# EAGLE design Upper-Board (EAGLE 7.1.0)
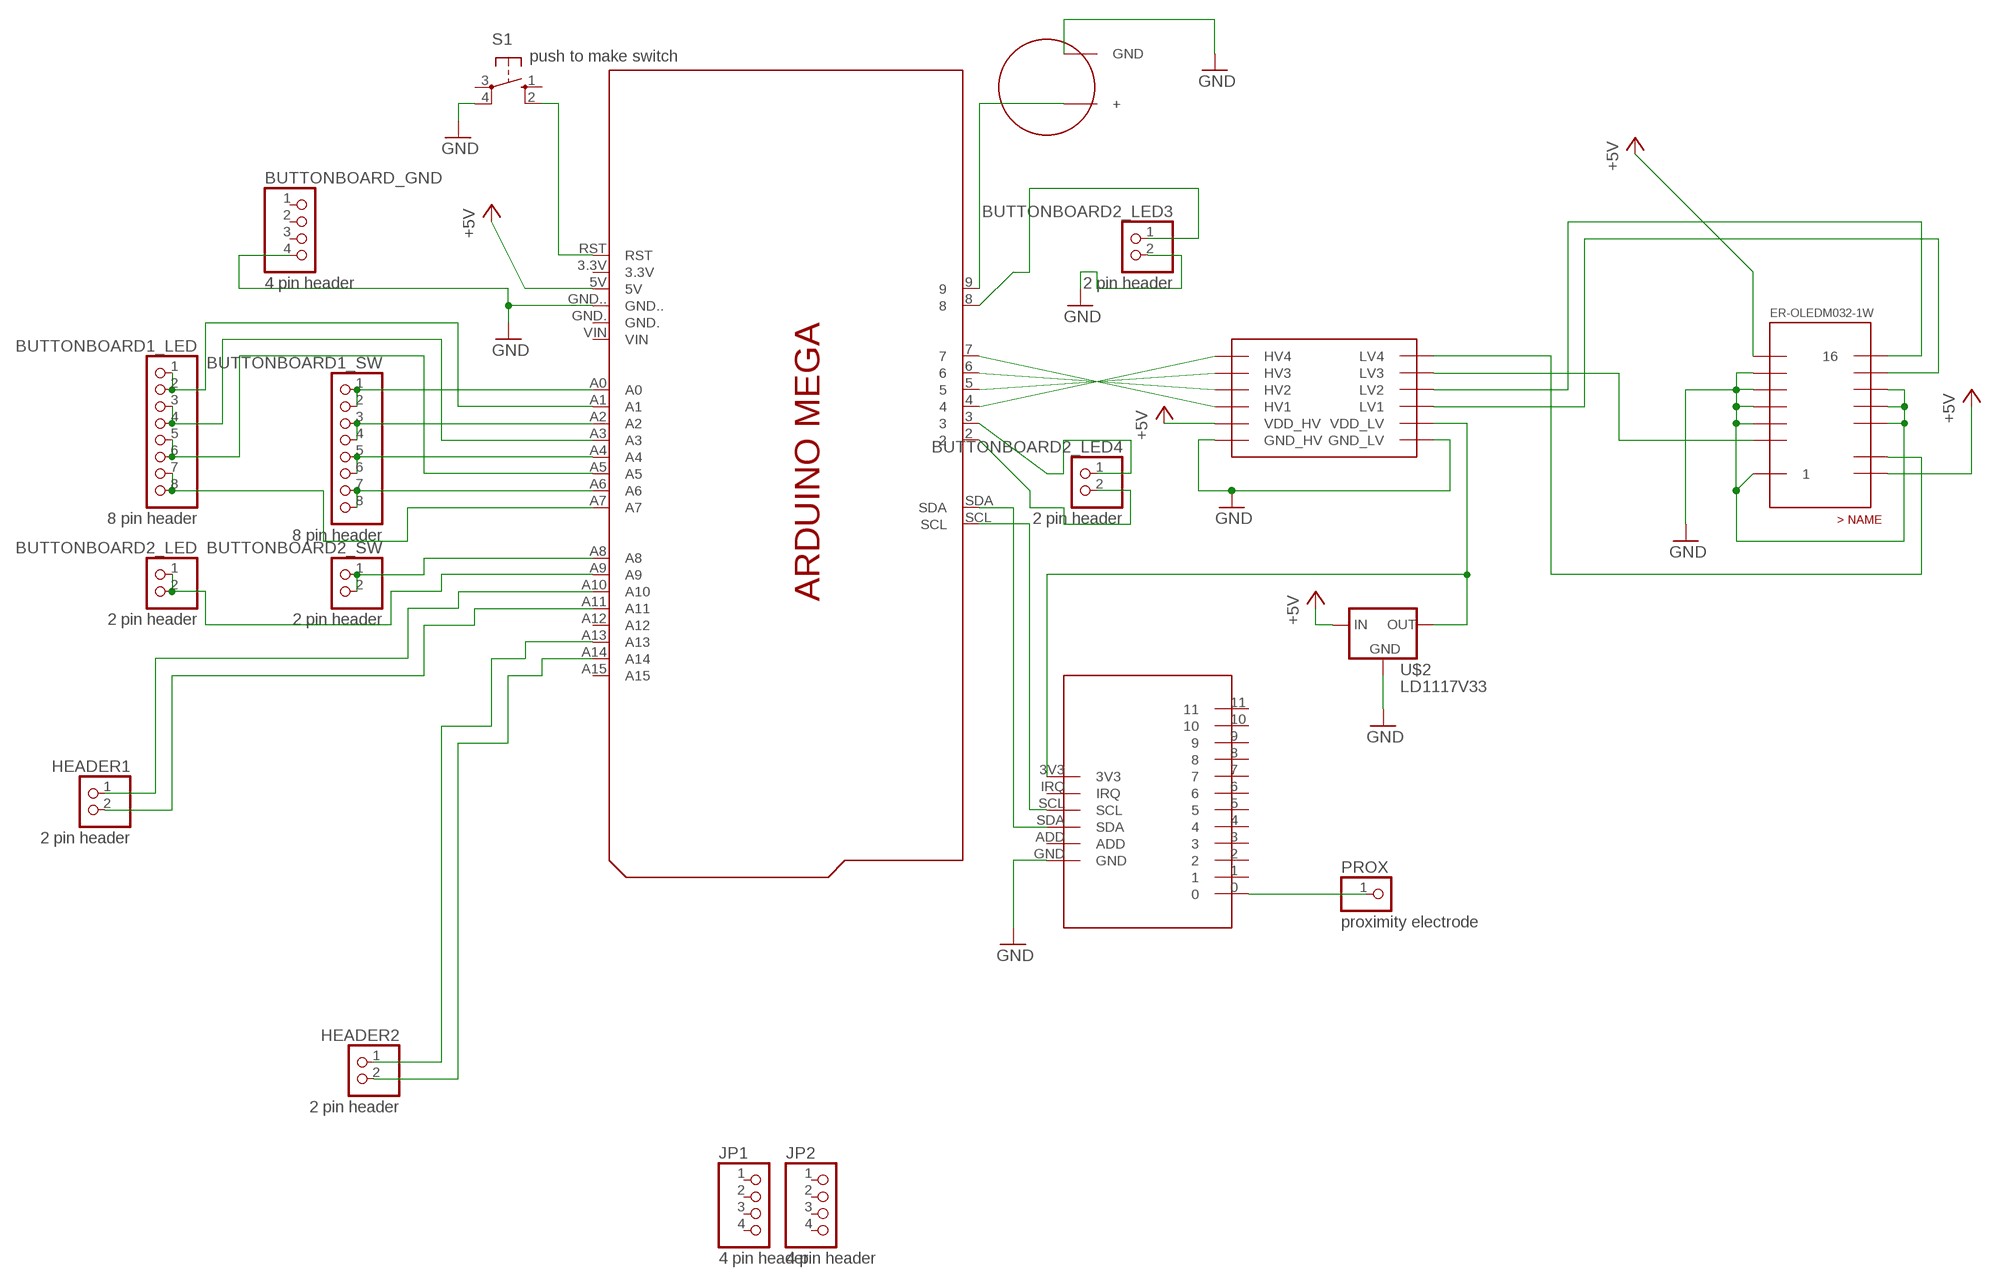
[diagram p0: schematic, sheet 1]

## Parts
BUTTONBOARD1_LED  8 pin header  PINHD-1X8  [1X08]
BUTTONBOARD1_SW  8 pin header  PINHD-1X8  [1X08]
BUTTONBOARD2_LED  2 pin header  PINHD-1X2  [1X02]
BUTTONBOARD2_LED3  2 pin header  PINHD-1X2  [1X02]
BUTTONBOARD2_LED4  2 pin header  PINHD-1X2  [1X02]
BUTTONBOARD2_SW  2 pin header  PINHD-1X2  [1X02]
BUTTONBOARD_GND  4 pin header  PINHD-1X4  [1X04]
HEADER1  2 pin header  PINHD-1X2  [1X02]
HEADER2  2 pin header  PINHD-1X2  [1X02]
JP1  4 pin header  PINHD-1X4  [1X04]
JP2  4 pin header  PINHD-1X4  [1X04]
PROX  proximity electrode  PINHD-1X1  [1X01]
S1  push to make switch  10-XX  [B3F-10XX]
U$1  ARDUINO_MEGA_2  [ARDUINO_MEGA_2]
U$2  LD1117V33  [LD1117V33]
U$3  ER-OLED-M032-1W  [ER-OLED-M032-1W]
U$4  BI_DIRECTIONAL_LEVEL_CONV  [BI_DIRECTIONAL_LEVEL_CONV]
U$5  MPR121_BREAKOUT  [MPR121_BREAKOUT]
U$6  BUZZER  [BUZZER]

## Nets
+5V: U$1.5V U$2.IN U$3.2 U$3.15 U$4.VDD_HV
GND: BUTTONBOARD2_LED3.2 BUTTONBOARD_GND.4 S1.4(P1) U$1.GND.. U$2.GND U$3.1 U$3.7 U$3.8 U$3.9 U$3.10 U$3.11 U$3.12 U$3.13 U$4.GND_HV U$4.GND_LV U$5.GND U$6.GND
N$1: BUTTONBOARD1_SW.1 BUTTONBOARD1_SW.2 U$1.A0
N$2: BUTTONBOARD1_SW.3 BUTTONBOARD1_SW.4 U$1.A2
N$3: BUTTONBOARD1_SW.5 BUTTONBOARD1_SW.6 U$1.A4
N$4: BUTTONBOARD1_SW.7 BUTTONBOARD1_SW.8 U$1.A6
N$5: BUTTONBOARD2_SW.1 BUTTONBOARD2_SW.2 U$1.A8
N$6: BUTTONBOARD1_LED.1 BUTTONBOARD1_LED.2 U$1.A1
N$7: U$1.SDA U$5.SDA
N$8: BUTTONBOARD1_LED.3 BUTTONBOARD1_LED.4 U$1.A3
N$9: BUTTONBOARD1_LED.5 BUTTONBOARD1_LED.6 U$1.A5
N$10: BUTTONBOARD1_LED.7 BUTTONBOARD1_LED.8 U$1.A7
N$11: S1.2(S1) U$1.RST
N$12: BUTTONBOARD2_LED.1 BUTTONBOARD2_LED.2 U$1.A9
N$13: U$1.SCL U$5.SCL
N$14: PROX.1 U$5.0
N$15: U$1.9 U$6.+
N$19: BUTTONBOARD2_LED3.1 U$1.8
N$20: BUTTONBOARD2_LED4.1 U$1.3
N$21: BUTTONBOARD2_LED4.2 U$1.2
N$22: U$1.4 U$4.HV4
N$23: U$1.5 U$4.HV3
N$24: U$1.6 U$4.HV2
N$25: U$1.7 U$4.HV1
N$26: U$2.OUT U$4.VDD_LV U$5.3V3
N$27: U$3.14 U$4.LV1
N$28: U$3.16 U$4.LV2
N$30: U$3.5 U$4.LV3
N$31: U$3.4 U$4.LV4
N$32: HEADER2.1 U$1.A13
N$33: HEADER2.2 U$1.A14
N$34: HEADER1.1 U$1.A10
N$35: HEADER1.2 U$1.A11
Unconnected: BUTTONBOARD_GND.1 BUTTONBOARD_GND.2 BUTTONBOARD_GND.3 JP1.1 JP1.2 JP1.3 JP1.4 JP2.1 JP2.2 JP2.3 JP2.4 S1.1(S) S1.3(P) U$1.3.3V U$1.A12 U$1.A15 U$1.GND. U$1.VIN U$5.1 U$5.2 U$5.3 U$5.4 U$5.5 U$5.6 U$5.7 U$5.8 U$5.9 U$5.10 U$5.11 U$5.ADD U$5.IRQ

## Library data of the parts
BUTTONBOARD1_LED BUTTONBOARD1_SW = pinhead:PINHD-1X8: PIN HEADER
BUTTONBOARD2_LED BUTTONBOARD2_LED3 BUTTONBOARD2_LED4 BUTTONBOARD2_SW HEADER1 HEADER2 = pinhead:PINHD-1X2: PIN HEADER
BUTTONBOARD_GND JP1 JP2 = pinhead:PINHD-1X4: PIN HEADER
PROX = pinhead:PINHD-1X1: PIN HEADER
S1 = switch-omron:10-XX: OMRON SWITCH; MPN: B3F-1000; OC_FARNELL: 176432; OC_NEWARK: 36M3542
U$1 = Mat-Library:ARDUINO_MEGA_2
U$2 = LD1117V33:LD1117V33
U$3 = Mat-Library:ER-OLED-M032-1W: 256x64 White OLED from buydisplay.com. ER-OLED-M032-1W ER = East Rising (Manufacturer) OLED = OLED M = module - this is the product with the driver board
U$4 = Mat-Library:BI_DIRECTIONAL_LEVEL_CONV
U$5 = Mat-Library:MPR121_BREAKOUT
U$6 = Mat-Library:BUZZER

## Board
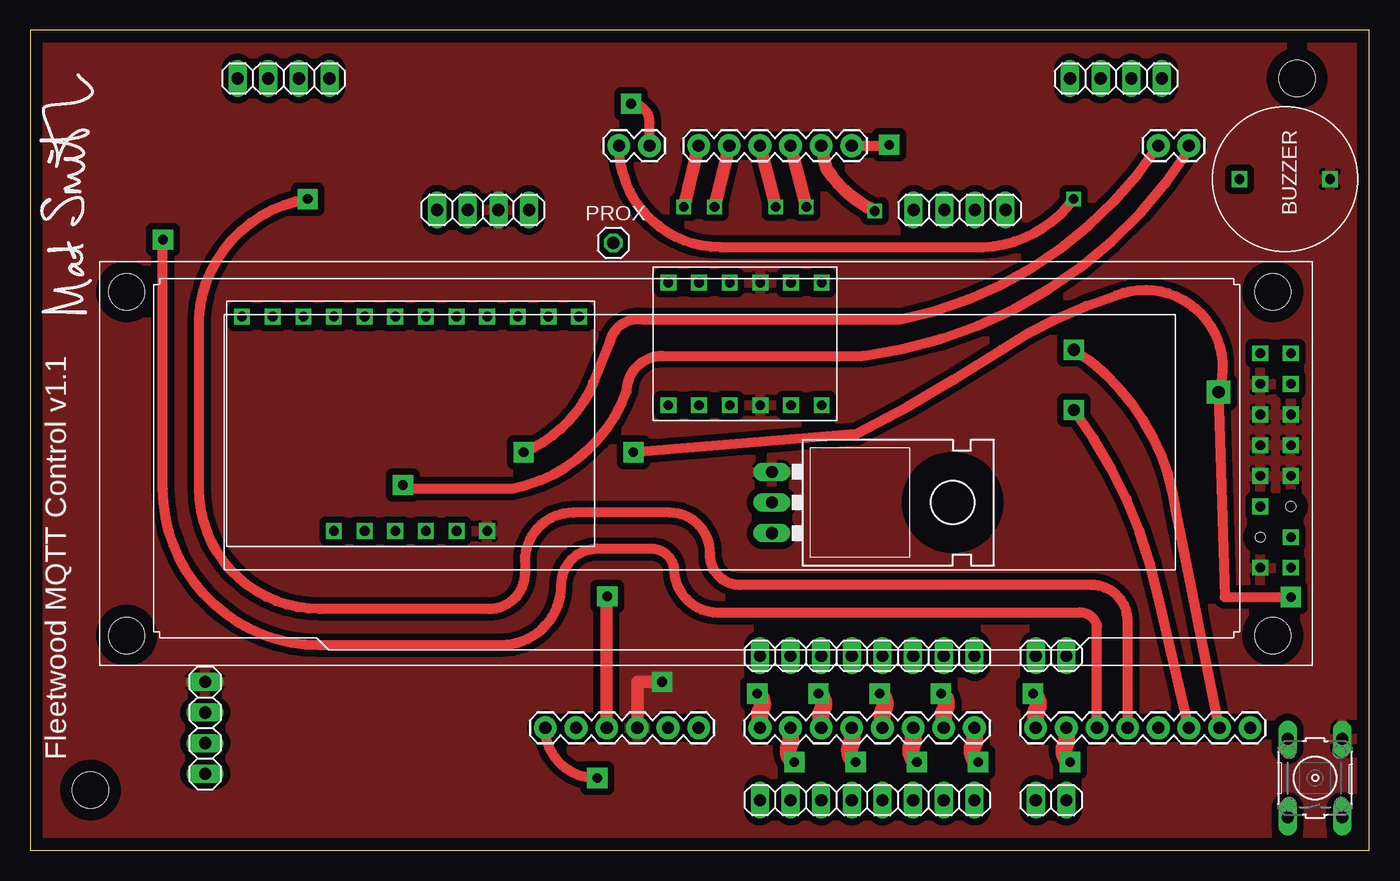
[diagram p1: board, top side]
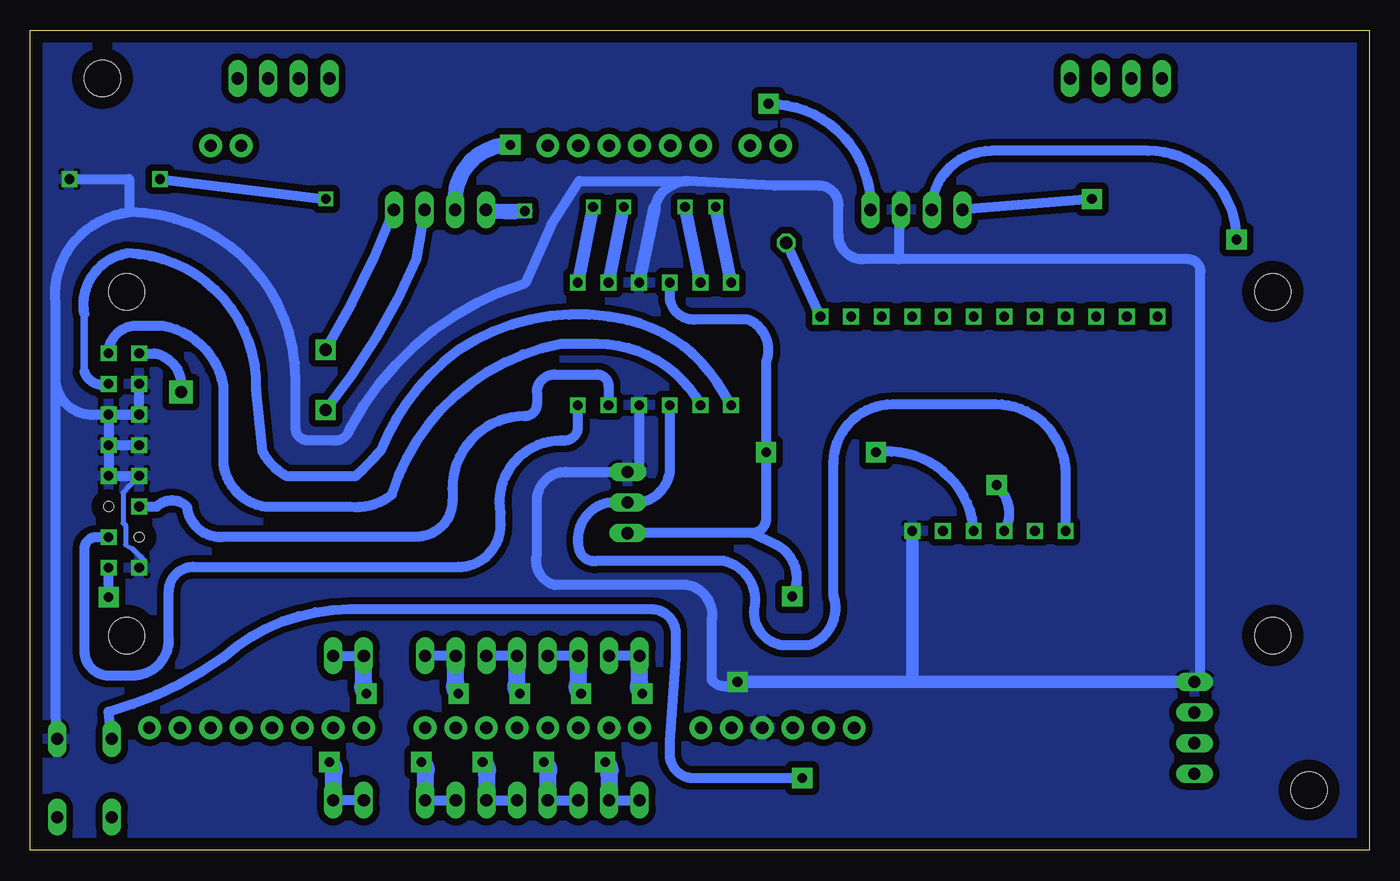
[diagram p2: board, bottom side, seen from below]

Size 111 x 68 mm. Coordinates in mm from the lower left corner, seen from the top.
Outline: 0,0 111,0 111,68 0,68 0,0
Copper layers (1*16): Top 0.035mm / dielectric 1.5mm / Bottom 0.035mm
Design rules "mat-homemade *": minimum track width 20mil, minimum drill 24mil, track to track 22mil, track to pad 22mil, pad to pad 22mil, via to via 22mil, smd to smd 8mil, copper to edge 40mil, drill to drill 8mil, minimum pad ring 10mil, minimum via ring 8mil, stop-mask expansion 4mil, vias tented up to drill 0mil, thermal gap 10mil
Holes 3 mm at 5,5 105,64

### Footprints (pad centres in the part's own frame; a part is rotated, then mirrored left to right if it is on the bottom)
1X08 = drill 1.016 long: 1 -8.89,0; 2 -6.35,0; 3 -3.81,0; 4 -1.27,0; 5 1.27,0; 6 3.81,0; 7 6.35,0; 8 8.89,0
1X02 = drill 1.016 long: 1 -1.27,0; 2 1.27,0
1X04 = drill 1.016 long: 1 -3.81,0; 2 -1.27,0; 3 1.27,0; 4 3.81,0
1X01 = drill 1.016 octagon: 1 0,0
B3F-10XX = drill 1.016 long: 1 -3.251,2.261; 2 3.251,2.261; 3 -3.251,-2.261; 4 3.251,-2.261
ARDUINO_MEGA_2 = drill 1.016 pad 1.88: 2 26.67,50.8; 3 24.13,50.8; 3.3V 3.81,2.54; 4 21.59,50.8; 5 19.05,50.8; 5V 6.35,2.54; 6 16.51,50.8; 7 13.97,50.8; 8 9.906,50.8; 9 7.366,50.8; A0 19.05,2.54; A1 21.59,2.54; A2 24.13,2.54; A3 26.67,2.54; A4 29.21,2.54; A5 31.75,2.54; A6 34.29,2.54; A7 36.83,2.54; A8 41.91,2.54; A9 44.45,2.54; A10 46.99,2.54; A11 49.53,2.54; A12 52.07,2.54; A13 54.61,2.54; A14 57.15,2.54; A15 59.69,2.54; GND. 11.43,2.54; GND.. 8.89,2.54; RST 1.27,2.54; SCL 54.61,50.8; SDA 52.07,50.8; VIN 13.97,2.54
LD1117V33 = drill 1.016 long: GND -2.54,-8.89; IN 2.54,-8.89; OUT 0,-8.89
ER-OLED-M032-1W = drill 0.8 square: 1 46.46,-9.57; 2 49,-9.57; 4 49,-7.03; 5 46.46,-4.49; 7 46.46,-1.95; 8 49,-1.95; 9 46.46,0.59; 10 49,0.59; 11 46.46,3.13; 12 49,3.13; 13 46.46,5.67; 14 49,5.67; 15 46.46,8.21; 16 49,8.21 | hole 3: 47.5,-15.18; 47.5,13.32; -47.5,-15.18; -47.5,13.32 | hole 0.8: 46.46,-7.03; 49,-4.49
BI_DIRECTIONAL_LEVEL_CONV = drill 0.8 square: GND_HV 1.27,5.08; GND_LV 1.27,-5.08; HV1 -6.35,5.08; HV2 -3.81,5.08; HV3 3.81,5.08; HV4 6.35,5.08; LV1 -6.35,-5.08; LV2 -3.81,-5.08; LV3 3.81,-5.08; LV4 6.35,-5.08; VDD_HV -1.27,5.08; VDD_LV -1.27,-5.08
MPR121_BREAKOUT = drill 0.8 square: 0 2.54,2.54; 1 5.08,2.54; 2 7.62,2.54; 3 10.16,2.54; 3V3 22.86,20.32; 4 12.7,2.54; 5 15.24,2.54; 6 17.78,2.54; 7 20.32,2.54; 8 22.86,2.54; 9 25.4,2.54; 10 27.94,2.54; 11 30.48,2.54; ADD 12.7,20.32; GND 10.16,20.32; IRQ 20.32,20.32; SCL 17.78,20.32; SDA 15.24,20.32
BUZZER = drill 0.8 square: + 0,3.75; GND 0,-3.75

### Placement (x,y rotation side)
BUTTONBOARD1_LED  69.38,4.16 0 top
BUTTONBOARD1_SW  69.38,16.13 0 top
BUTTONBOARD2_LED  84.61,4.16 0 top
BUTTONBOARD2_LED3  40.08,53.1 180 top
BUTTONBOARD2_LED4  74.5,53.1 0 top
BUTTONBOARD2_SW  84.61,16.13 0 top
BUTTONBOARD_GND  14.5,10.16 90 top
HEADER1  35,53.1 180 top
HEADER2  79.58,53.1 0 top
JP1  21,64 0 top
JP2  90,64 0 top
PROX  48.33,50.37 0 top
S1  106.5,6 90 top
U$1  41.44,7.62 0 top
U$2  70.37,28.84 270 top
U$3  55.5,33 0 top
U$4  59.25,41.99 0 top
U$5  48.04,46.8 180 top
U$6  104,55.65 90 top

### Tracks (layer width: path | path; a pad name or v marks a point on that pad's centre or on a via)
+5V  (via drill 0.8 pad 1.68, 1 pad 1.93)
  Top 0.813: v50,33 68.5,34.5 arc6 80.5,41.5 arc-16 90,46 arc-131 v98.5,38 99,21 v104.5,21
  Top 1.016: U$1.5V 47.78,21.09 arc90 v47.83,21.05
  Bottom 0.813: 51.2,26.3 U$2.IN | 51.2,26.3 arc-90 50,27.5 v50,33 50,40.5 arc-90 51.5,44 56,44 arc90 57.98,45.98 U$4.VDD_HV | U$3.15 100.71,41.21 arc90 v98.5,38 | v104.5,21 U$3.2 | v47.83,21.05 arc-90 49.08,25.3 51.2,26.3
GND  (via drill 0.8 pad 1.68)
  Top 1.016: U$1.GND.. 50.33,13.97 v52.37,13.97
  Bottom 0.406: U$3.7 103,30 103.29,29.64 103.29,27.14 103.1,26.94 103.09,25.34 102.5,25 101.5,24 101.5,23.89 U$3.1
  Bottom 0.813: U$4.GND_LV 60.52,31.34 arc90 U$2.GND 66.62,31.38 arc-90 69,29 69,24.5 arc-90 67.5,22 56.5,22 arc90 54.5,19 54.5,14.1 arc-90 v52.37,13.97 | 59.25,53.25 arc78 56.5,55.5 | 108.9,38.8 arc-90 105.43,36.13 U$3.12 | U$3.12 U$3.11 U$3.13 | U$3.12 U$3.10 | U$3.10 U$3.9 | U$3.10 U$3.8 U$3.7 | 108.9,38.8 108.9,45.3 arc90 102.8,52.9 | 56.5,55.5 49.3,55.1 45.6,55.1 arc90 44,53.5 44,51 arc-90 42,49 39,49 | 56.5,55.5 65.5,55.5 67.8,51.9 70,47 arc-44 84.5,35 arc90 86,34 88,34 arc90 89,35 89,39.1 arc-90 102.8,52.9 | BUTTONBOARD2_LED3.2 arc-90 39,52.91 39,49 | 39,49 15,49 arc90 14,48 14,13.97 BUTTONBOARD_GND.4 | S1.4 108.9,11.25 108.9,38.8 | U$6.GND 102.8,55.65 102.8,52.9
  Bottom 1.016: v52.37,13.97 37.88,13.97 | 37.88,13.97 BUTTONBOARD_GND.4 | U$5.GND 37.88,13.97 | U$4.GND_HV 59.25,53.25
  pour Top: 0,69 112,69 112,-1 -1,-1 -1,69
  pour Bottom: -1,69 112,69 112,-1 -1,-1
N$1  (via drill 0.8 pad 1.68)
  Top 1.422: U$1.A0 60.48,11.47 arc90 v60.26,13
  Bottom 0.813: BUTTONBOARD1_SW.1 BUTTONBOARD1_SW.2
  Bottom 1.422: v60.26,13 arc90 60.48,13.93 BUTTONBOARD1_SW.1
N$2  (via drill 0.8 pad 1.68)
  Top 1.422: U$1.A2 65.56,11.47 arc90 v65.34,13
  Bottom 0.813: BUTTONBOARD1_SW.3 BUTTONBOARD1_SW.4
  Bottom 1.422: v65.34,13 arc90 65.56,13.93 BUTTONBOARD1_SW.3
N$3  (via drill 0.8 pad 1.68)
  Top 1.422: U$1.A4 70.65,11.47 arc90 v70.42,13
  Bottom 0.813: BUTTONBOARD1_SW.5 BUTTONBOARD1_SW.6
  Bottom 1.422: v70.42,13 arc90 70.65,13.93 BUTTONBOARD1_SW.5
N$4  (via drill 0.8 pad 1.68)
  Top 1.422: U$1.A6 75.72,11.47 arc90 v75.5,13
  Bottom 0.813: BUTTONBOARD1_SW.7 BUTTONBOARD1_SW.8
  Bottom 1.422: v75.5,13 arc90 75.72,13.93 BUTTONBOARD1_SW.7
N$5  (via drill 0.8 pad 1.68)
  Top 1.422: U$1.A8 83.34,11.47 arc90 v83.12,13
  Bottom 0.813: BUTTONBOARD2_SW.2 BUTTONBOARD2_SW.1
  Bottom 1.422: v83.12,13 arc90 83.34,13.93 BUTTONBOARD2_SW.1
N$6  (via drill 0.8 pad 1.68)
  Top 1.422: U$1.A1 63.02,8.94 arc90 v63.34,7.32
  Bottom 0.813: BUTTONBOARD1_LED.2 BUTTONBOARD1_LED.1
  Bottom 1.422: v63.34,7.32 arc90 63.02,6.3 BUTTONBOARD1_LED.2
N$7  (via drill 0.8 pad 1.68)
  Top 0.813: U$1.SDA arc-45 72.09,44 50.8,44 arc90 48,42 46.65,38.75 arc-46 v40.9,33
  Bottom 0.813: U$5.SDA 32.8,26.9 arc-90 v40.9,33
N$8  (via drill 0.8 pad 1.68)
  Top 1.422: U$1.A3 68.1,8.94 arc90 v68.42,7.32
  Bottom 0.813: BUTTONBOARD1_LED.4 BUTTONBOARD1_LED.3
  Bottom 1.422: v68.42,7.32 arc90 68.1,6.3 BUTTONBOARD1_LED.4
N$9  (via drill 0.8 pad 1.68)
  Top 1.422: U$1.A5 73.19,8.94 arc90 v73.5,7.32
  Bottom 0.813: BUTTONBOARD1_LED.6 BUTTONBOARD1_LED.5
  Bottom 1.422: v73.5,7.32 arc90 73.19,6.3 BUTTONBOARD1_LED.6
N$10  (via drill 0.8 pad 1.68)
  Top 1.422: U$1.A7 78.27,8.94 arc90 v78.58,7.32
  Bottom 0.813: BUTTONBOARD1_LED.8 BUTTONBOARD1_LED.7
  Bottom 1.422: v78.58,7.32 arc90 78.27,6.3 BUTTONBOARD1_LED.8
N$11  (via drill 0.8 pad 1.68)
  Top 0.813: v47,6 46.87,6 arc-90 U$1.RST
  Bottom 0.813: S1.2 104.5,11.5 arc-20 95,16 arc42 84.5,20 59.5,20 arc90 57.5,18 57.5,16 58,9 58,8 arc-90 56,6 v47,6
N$12  (via drill 0.8 pad 1.68)
  Top 1.422: U$1.A9 85.89,8.94 arc90 v86.2,7.32
  Bottom 0.813: BUTTONBOARD2_LED.1 BUTTONBOARD2_LED.2
  Bottom 1.422: v86.2,7.32 arc90 85.89,6.3 BUTTONBOARD2_LED.2
N$13  (via drill 0.8 pad 1.68)
  Top 0.813: U$1.SCL 96.05,58.05 arc-50 69,41 52.4,41 arc90 49.45,38.05 arc-58 40,30 31.2,30 v30.9,30.3
  Bottom 0.813: v30.9,30.3 30.5,29.8 arc69 U$5.SCL
N$14
  Bottom 0.813: U$5.0 PROX.1
N$15  (via drill 0.8)
  Top 0.813: U$1.9 arc90 57.22,50 79,50 arc50 v86.5,54
  Bottom 0.813: U$6.+ v86.5,54
N$19  (via drill 0.8 pad 1.68)
  Top 0.813: U$1.8 51.34,60.36 arc90 v49.8,61.9
  Bottom 0.813: v49.8,61.9 arc90 41.35,53.45 BUTTONBOARD2_LED3.1
N$20  (via drill 0.8)
  Top 1.016: U$1.3 66,56.5 arc30 v70,53
  Bottom 1.27: v70,53 arc14 BUTTONBOARD2_LED4.1
N$21  (via drill 0.8 pad 1.68)
  Top 0.813: U$1.2 71.2,58.42 v71.2,58.5
  Bottom 0.813: v71.2,58.5 71.2,58.07
  Bottom 1.27: BUTTONBOARD2_LED4.2 75.77,53.93 arc90 v71.2,58.5
N$22  (via drill 0.8)
  Top 1.016: U$1.4 v64.34,53.34
  Bottom 1.016: v64.34,53.34 U$4.HV4
N$23  (via drill 0.8)
  Top 1.016: U$1.5 v61.8,53.34
  Bottom 1.016: v61.8,53.34 U$4.HV3
N$24  (via drill 0.8)
  Top 1.016: U$1.6 v56.72,53.34
  Bottom 1.016: v56.72,53.34 U$4.HV2
N$25  (via drill 0.8)
  Top 1.016: U$1.7 v54.18,53.34
  Bottom 1.016: v54.18,53.34 U$4.HV1
N$26
  Bottom 0.813: 57.98,36.48 U$4.VDD_LV 57.98,31.34 arc90 U$2.OUT 63.16,28.84 arc-90 65.5,25 arc-90 64,24 53.5,24 arc90 51,20 arc-90 48.5,17 46.5,17 arc-90 44.4,21.1 44.4,32.1 arc90 39.5,37 31,37 arc90 25.18,31.18 U$5.3V3
N$27
  Bottom 0.61: 106.5,39.67 106.5,44.5
  Bottom 0.813: U$3.14 arc90 106.5,39.67 | 106.5,44.5 arc90 103,49.5 arc90 92.25,38.25 91.75,33.05 arc-34 89.7,31 84.05,31 arc-6 82,33.05 arc31 75.5,41.5 arc46 61.45,43.95 arc48 53.55,37.95 U$4.LV1
N$28
  Bottom 0.813: U$4.LV2 arc-61 64,42 67,42 arc-62 81,29.5 arc46 84.5,28.5 91.5,28.5 arc74 95,32 95,38.5 arc-70 100,43.5 102.21,43.5 arc-90 U$3.16
N$30
  Bottom 0.813: U$3.5 100.51,28.51 arc90 98,28.5 arc-90 95,26 79,26 arc-90 76,29 76,30 arc90 70,36 arc-90 69,37 69,38 arc90 67.55,39.45 64,39.45 arc90 63.06,38.51 U$4.LV3
N$31
  Bottom 0.813: U$4.LV4 65.6,34.9 arc90 67,34 arc-100 72,28 72,27 arc90 75.5,23.5 97.5,23.5 arc-90 99.5,21.5 99.5,17.5 arc90 102.5,14.5 104.5,14.5 arc90 106.5,16.5 106.5,25 arc90 105.53,25.97 U$3.4
N$32  (via drill 1 pad 1.68)
  Top 0.813: U$1.A13 93.5,21 arc25 v86.5,36.5
  Bottom 0.813: HEADER2.1 79,49 arc15 v86.5,36.5
N$33  (via drill 1 pad 1.68)
  Top 0.813: U$1.A14 95,28 arc50 v86.5,41.5
  Bottom 0.813: v86.5,41.5 arc-10 HEADER2.2
N$34  (via drill 0.8 pad 1.68)
  Top 0.813: U$1.A10 88.42,18.57 arc90 86.8,19.7 57.3,19.7 arc-90 53.4,23.1 arc90 51.5,25 47,25 arc90 44,22 arc-90 39,17 24,17 arc-90 11,30 v11,50.63
  Bottom 0.813: HEADER1.1 arc90 31.37,58 18.37,58 arc90 v11,50.63
N$35  (via drill 0.8 pad 1.68)
  Top 0.813: U$1.A11 90.97,19.04 arc90 88,22 58.85,22 arc-90 56.35,24.5 56.35,24.65 arc90 53,28 45,28 arc90 41,24 41,23 arc-90 38,20 24,20 arc-90 14,30 14,43 arc-84 v23,54
  Bottom 0.813: v23,54 HEADER1.2

### Text on the board
tNames: Fleetwood MQTT Control v1.1